# EAGLE design espurna (EAGLE 7.3.0)
PROJECT_AUTHOR: tinkerman.cat <xose.perez@gmail.com>; PROJECT_LICENSE: MIT; PROJECT_NAME: ESPURNA; PROJECT_VERSION: 0.4.20160703
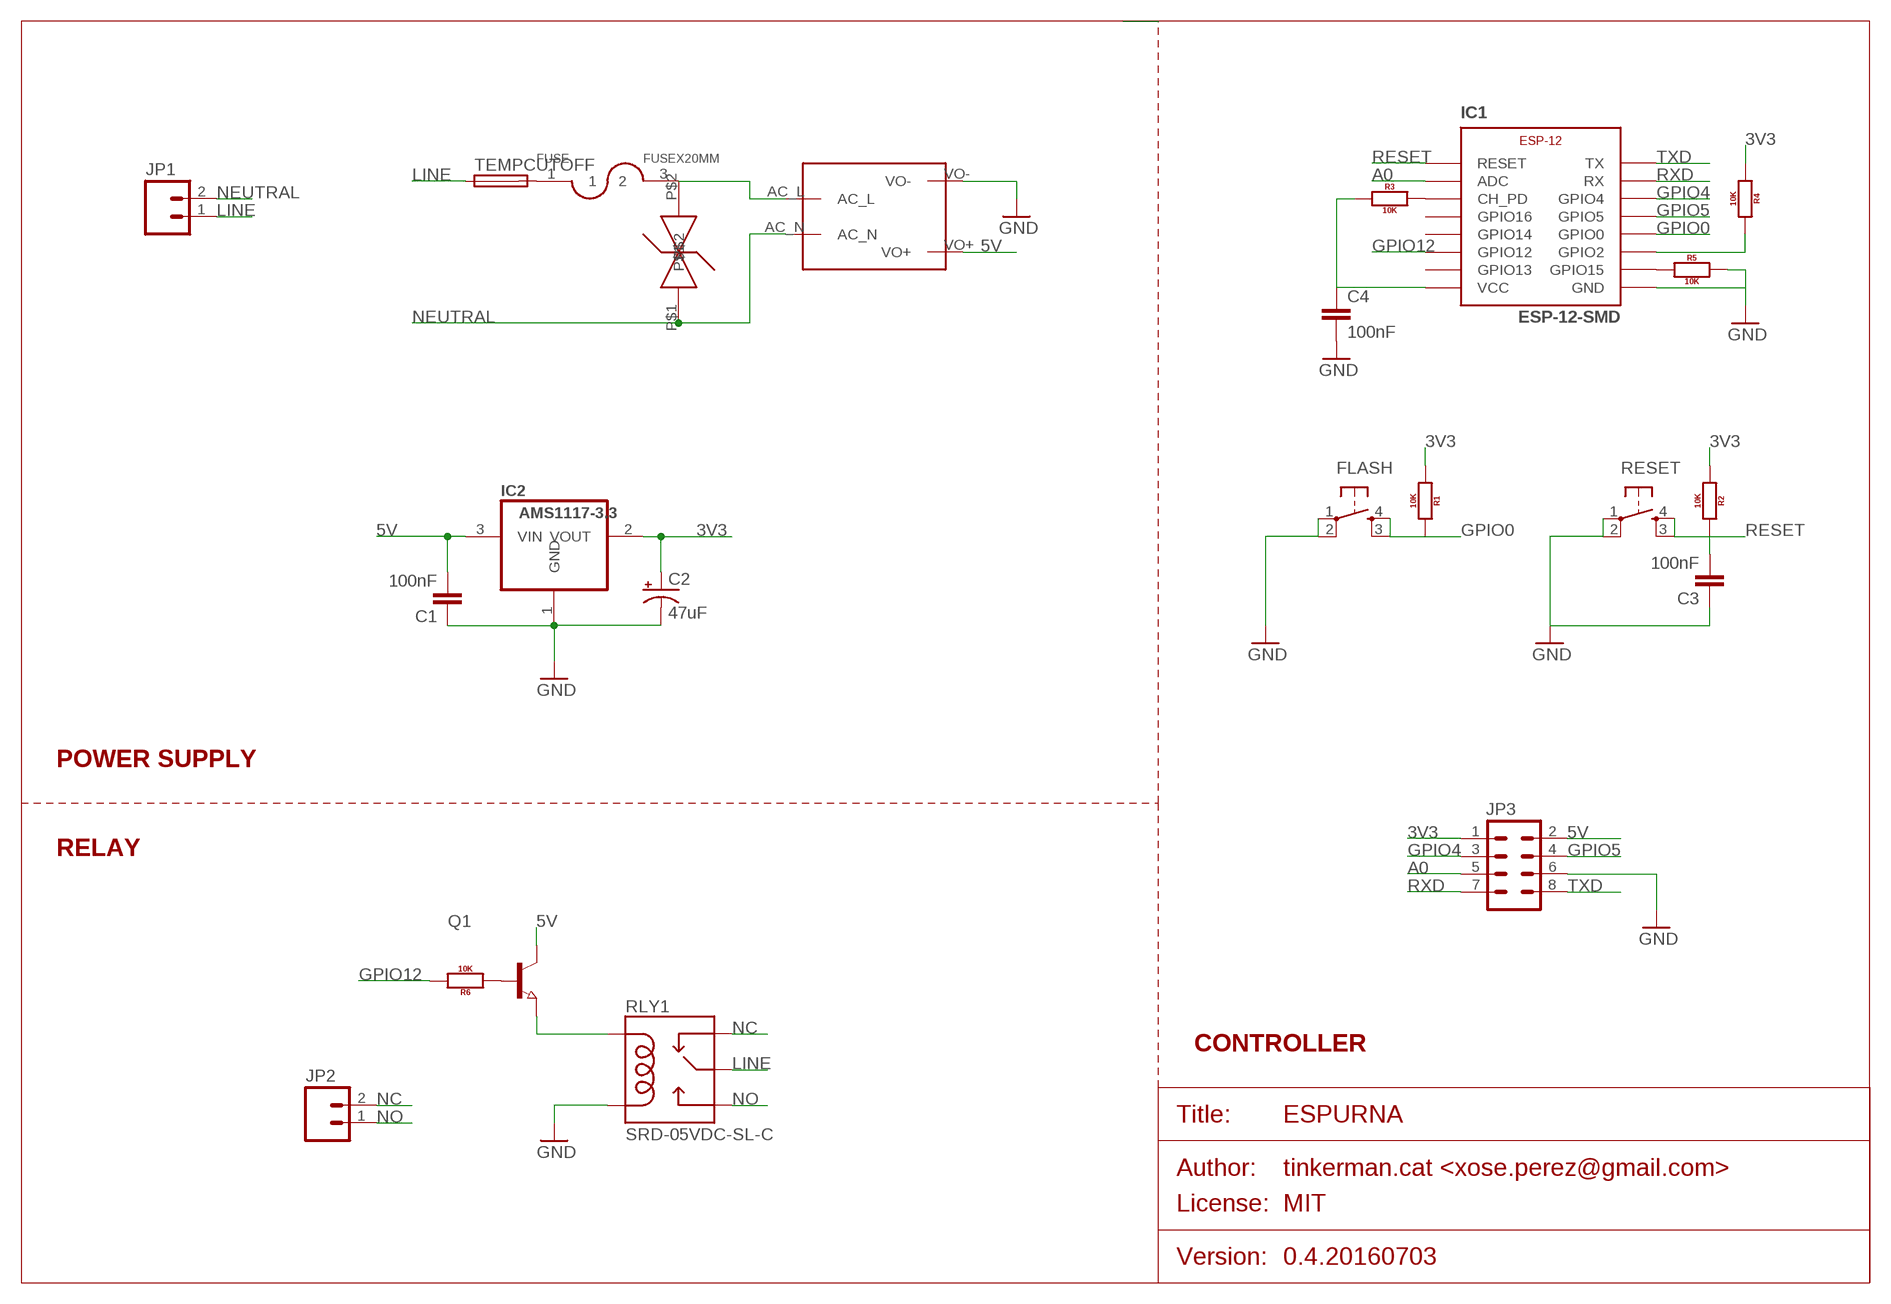
[diagram p0: schematic, sheet 1]

## Parts
C1  100nF  C-EU0805  [0805]
C2  47uF  CAP_POLC  [PANASONIC_C]
C3  100nF  C-EU0805  [0805]
C4  100nF  C-EU0805  [0805]
FLASH  TACTILE_BUTTON_SMD  [TACTILE-BUTTON-SMD]
FUSE  FUSEX20MM  [FUSE_5MM]
IC1  ESP-12-SMD  [ESP-12-SMD]
IC2  AMS1117-3.3  REG1117  [SOT223]
JP1  M02200MIL  [SCREWTERMINAL-200MIL-2]
JP2  M02200MIL  [SCREWTERMINAL-200MIL-2]
JP3  M04X2  [2X4]
Q1  NPN-TRANSISTOR_SOT23  [SOT23]
R1  10K  RESISTOR0805  [0805]
R2  10K  RESISTOR0805  [0805]
R3  10K  RESISTOR0805  [0805]
R4  10K  RESISTOR0805  [0805]
R5  10K  RESISTOR0805  [0805]
R6  10K  RESISTOR0805  [0805]
RESET  TACTILE_BUTTON_SMD  [TACTILE-BUTTON-SMD]
RLY1  SRD-05VDC-SL-C  RELAYSONGLE  [SRD-5VDC-SL-C]
TEMPCUTOFF  PICOFUSE  [PICOFUSE]
U$1  MAINS_CONVERTERS  [HLK-PM01]
VARISTOR  V18ZA2P  [V18ZA2P]

## Nets
3V3: C2.+ C4.1 IC1.VCC IC2.2(VOUT) JP3.1 R1.1 R2.1 R3.1 R4.1
5V: C1.2 IC2.3(VIN) JP3.2 Q1.3(C) U$1.VO+
A0: IC1.ADC JP3.5
GND: C1.1 C2.- C3.1 C4.2 FLASH.1(SWA1) FLASH.2(SWB1) IC1.GND IC2.1(GND) JP3.6 R5.2 RESET.1(SWA1) RESET.2(SWB1) RLY1.COIL2 U$1.VO-
GPIO0: FLASH.3(SWB2) FLASH.4(SWA2) IC1.GPIO0 R1.2
GPIO4: IC1.GPIO4 JP3.3
GPIO5: IC1.GPIO5 JP3.4
GPIO12: IC1.GPIO12 R6.2
LINE: JP1.1 RLY1.COMMON(MAIN) TEMPCUTOFF.1
N$1: IC1.CH_PD R3.2
N$3: IC1.GPIO15 R5.1
N$4: IC1.GPIO2 R4.2
N$5: Q1.1(B) R6.1
N$6: FUSE.1 TEMPCUTOFF.2
N$7: Q1.2(E) RLY1.COIL1
N$8: FUSE.3 U$1.AC_L VARISTOR.P$2
NC: JP2.2 RLY1.CLOSED(NC)
NEUTRAL: JP1.2 U$1.AC_N VARISTOR.P$1
NO: JP2.1 RLY1.OPEN(NO)
RESET: C3.2 IC1.RESET R2.2 RESET.3(SWB2) RESET.4(SWA2)
RXD: IC1.RX JP3.7
TXD: IC1.TX JP3.8
Unconnected: IC1.GPIO13 IC1.GPIO14 IC1.GPIO16

## Notes on the sheet
- POWER SUPPLY
- RELAY
- CONTROLLER

## Library data of the parts
C1 C3 C4 = xose:C-EU: CAPACITOR, European symbol
C2 = xose:CAP_POL: Capacitor Polarized These are standard SMD and PTH capacitors. Normally 10uF, 47uF, and 100uF in electrolytic and tantalum varieties. Always verify the external diameter of the through hole cap, it varies with capacity, voltage, and manufacturer. The EIA devices should be standard.
FLASH RESET = xose:TACTILE_BUTTON: Tactile Button SparkFun Electronics' Tactile Button COM-10302
FUSE = xose:FUSE
IC1 = xose:ESP-12
IC2 = xose:REG1117: 800mA and 1A Low Dropout (LDO) Positive Regulator 1.8V, 2.5V, 2.85V, 3.3V, 5V, and Adj; MPN: REG1117; OC_FARNELL: 1097566; OC_NEWARK: 14P6981
JP1 JP2 = xose:M02: Standard 2-pin 0.1" header. Use with - straight break away headers ( PRT-00116) - right angle break away headers (PRT-00553) - swiss pins (PRT-00743) - machine pins (PRT-00117) - female headers (PRT-00115) Molex polarized connector foot print use with: PRT-08233 with associated crimp pins and housings. 2.54_SCREWTERM for use with PRT-10571. 3.5mm Screw Terminal footprints for PRT-08084 5mm Screw Terminal footprints for use with PRT-08432
JP3 = xose:M04X2: .1" header, two rows of four.
Q1 = xose:NPN-TRANSISTOR_: NPN TRANSISTOR
R1-R6 = xose:RESISTOR: Generic EU resistor symbol
RLY1 = Spark:RELAY: SPDT relay (COM-00101)
TEMPCUTOFF = fuse:PICOFUSE: PICOFUSE 19275, Wickmann; OC_FARNELL: unknown; OC_NEWARK: unknown
U$1 = captain-slow:MAINS_CONVERTERS
VARISTOR = SparkFun-DiscreteSemi:V18ZA2P: Varistor

## Board
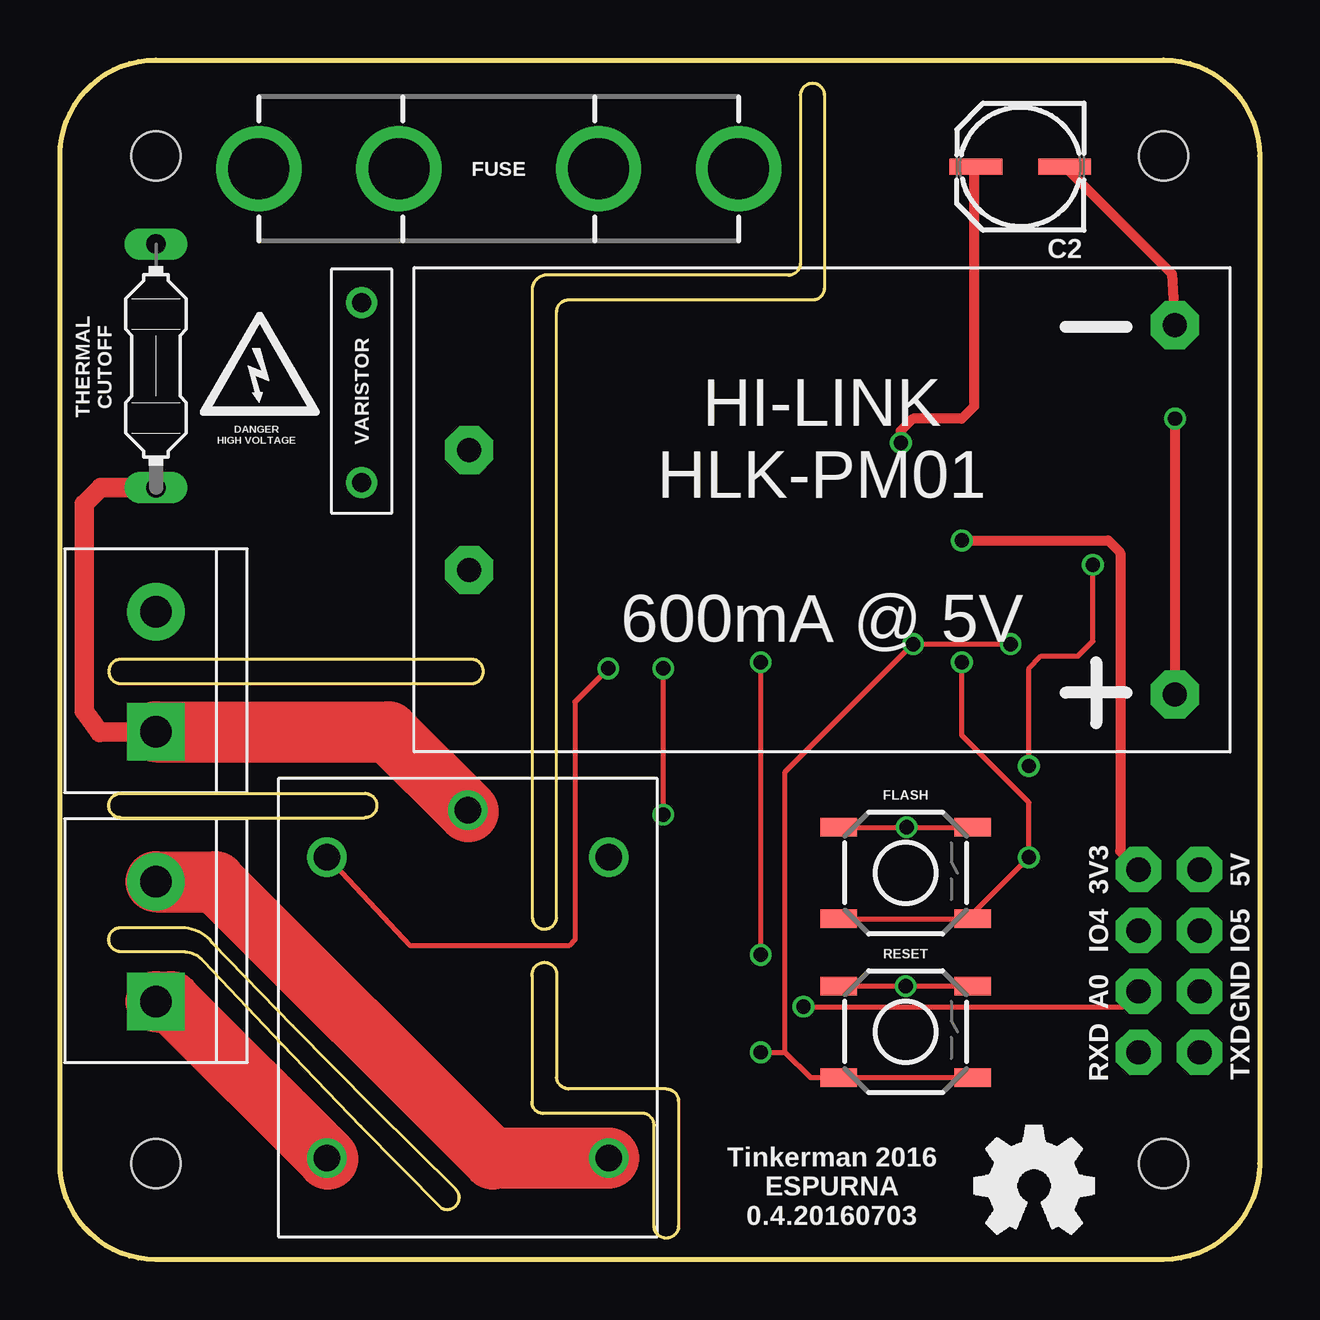
[diagram p1: board, top side]
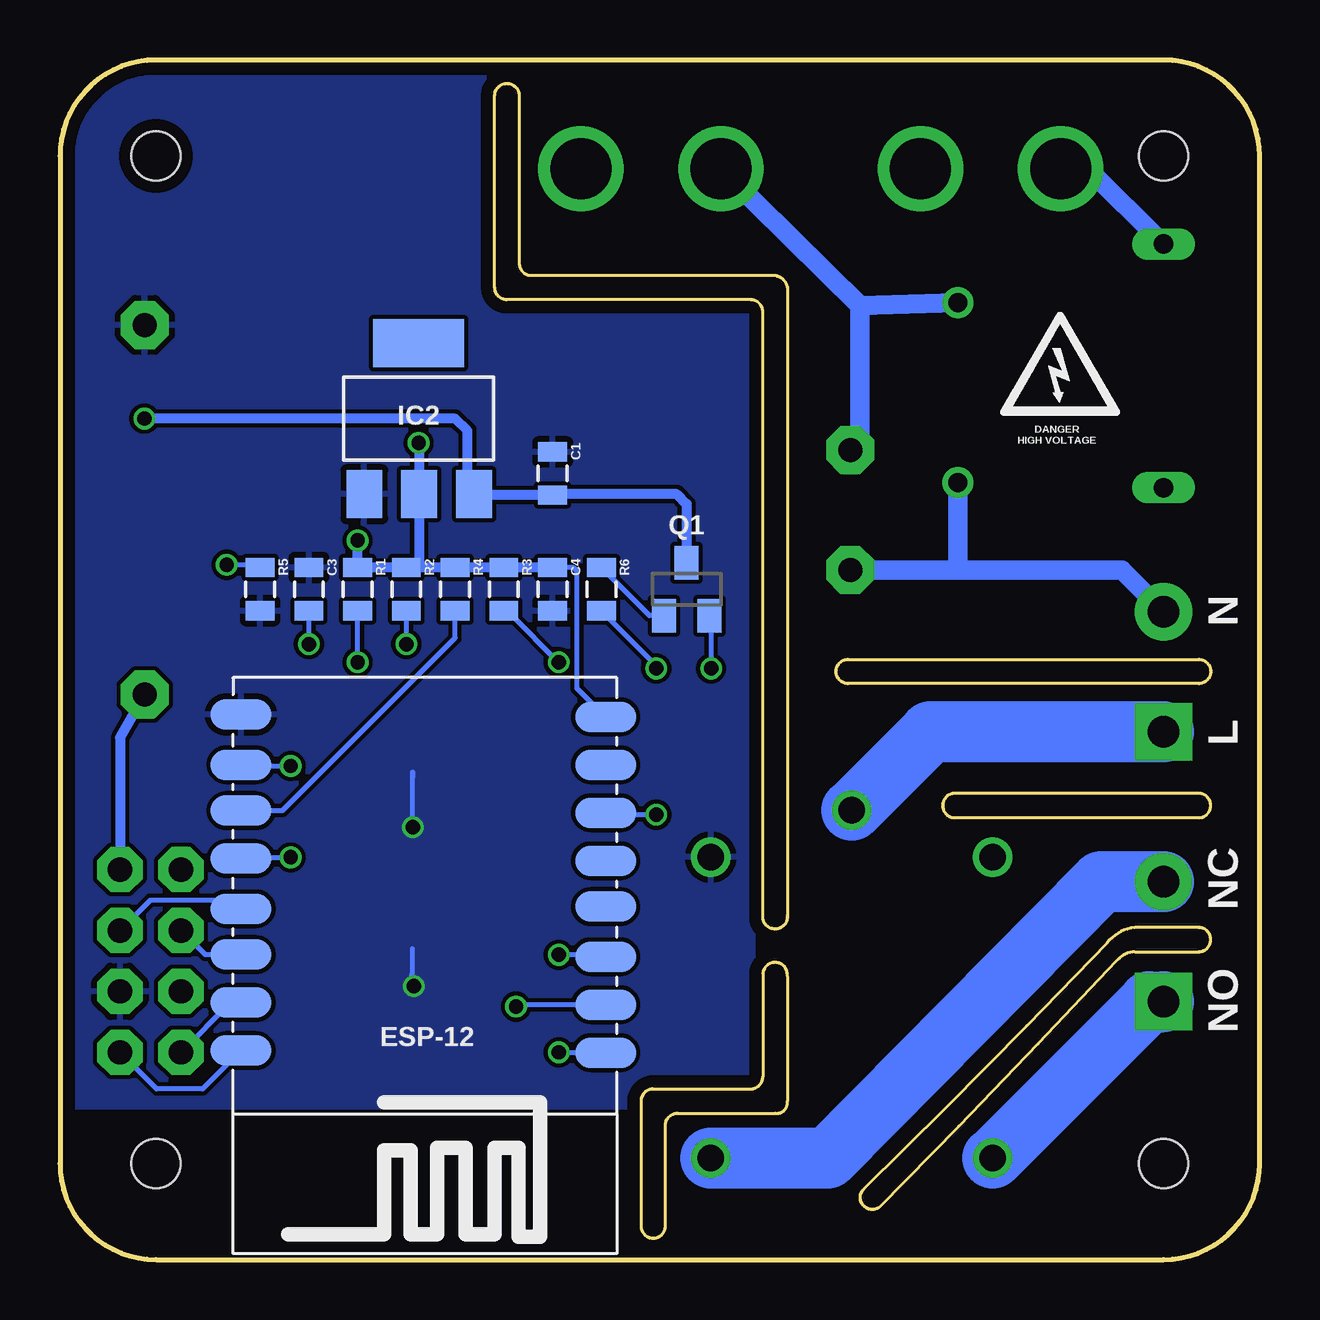
[diagram p2: board, bottom side, seen from below]

Size 50 x 50 mm. Coordinates in mm from the lower left corner, seen from the top.
Outline: 0,4 0,46 arc-90 4,50 46,50 arc-90 50,46 50,4 arc-90 46,0 4,0 arc-90 0,4
Outline: 5.21,12.83 arc-46 5.97,12.45 arc2 15.88,2.16 arc164 16.51,2.92 arc-2 6.35,13.21 arc44 5.21,13.84 2.54,13.84 arc180 2.54,12.83 5.21,12.83
Outline: 2.54,18.41 12.7,18.41 arc180 12.7,19.43 2.54,19.43 arc180 2.54,18.41
Outline: 2.54,24 17.14,24 arc180 17.14,25.02 2.54,25.02 arc180 2.54,24
Outline: 19.68,14.35 arc180 20.7,14.22 20.7,39.5 arc-90 21.21,40.01 31.37,40.01 arc90 31.88,40.51 31.88,48.51 arc180 30.86,48.51 30.86,41.53 arc-90 30.35,41.02 20.19,41.02 arc74 19.68,40.51 19.68,14.35
Outline: 19.68,11.81 arc-180 20.7,11.94 20.7,7.62 arc90 21.21,7.11 25.27,7.11 arc-90 25.78,6.6 25.78,1.4 arc-180 24.77,1.4 24.77,5.59 arc90 24.26,6.1 20.19,6.1 arc-106 19.68,6.6 19.68,11.81
Copper layers (1*16): Top 0.035mm / dielectric 1.5mm / Bottom 0.035mm
Design rules "smart-prototyping": minimum track width 7mil, minimum drill 12mil, track to track 7mil, track to pad 7mil, pad to pad 7mil, via to via 7mil, smd to smd 0mil, copper to edge 20mil, drill to drill 10mil, minimum pad ring 10mil, minimum via ring 6mil, stop-mask expansion 2mil, vias tented up to drill 25mil, thermal gap 10mil
Holes 2.03 mm at 4,4 46,4 46,46 4,46

### Footprints (pad centres in the part's own frame; a part is rotated, then mirrored left to right if it is on the bottom)
0805 = smd 0.8 x 1.2: 1 -0.9,0; 2 0.9,0
PANASONIC_C = smd 2.2 x 0.65: + 1.9,-0.2; - -1.8,-0.2
TACTILE-BUTTON-SMD = smd 1.524 x 0.762: 1 -2.794,1.905; 2 2.794,1.905; 3 -2.794,-1.905; 4 2.794,-1.905
FUSE_5MM = drill 2.54 pad 3.556: 1 0,-10; 2 0,-4.158; 3 0,4.158; 4 0,10
ESP-12-SMD = smd 2.54 x 1.27: ADC -7,5.1; CH_PD -7,3.1; GND 8.2,-7; GPIO0 8.2,-1; GPIO2 8.2,-3; GPIO4 8.2,3; GPIO5 8.2,1.1; GPIO12 -7,-2.9; GPIO13 -7,-4.9; GPIO14 -7,-0.9; GPIO15 8.2,-4.9; GPIO16 -7,1; RESET -7,7.1; RX 8.2,5; TX 8.2,7; VCC -7,-6.9
SOT223 = smd 1.499 x 2.007: 1 -2.261,-3.15; 2 0.025,-3.15; 3 2.311,-3.15 | smd 3.81 x 2.007: 4 0,3.15
SCREWTERMINAL-200MIL-2 = drill 1.3 pad 2.413 square: 1 0,0 | drill 1.3 pad 2.413: 2 5,0
2X4 = drill 1.016 pad 1.88 octagon: 1 -3.81,-1.27; 2 -3.81,1.27; 3 -1.27,-1.27; 4 -1.27,1.27; 5 1.27,-1.27; 6 1.27,1.27; 7 3.81,-1.27; 8 3.81,1.27
SOT23 = smd 1 x 1.4: 1 -0.95,-1.1; 2 0.95,-1.1; 3 0,1.1
SRD-5VDC-SL-C = drill 1.1: CLOSED -6.275,-5.875; COIL1 6.275,5.875; COIL2 6.275,-5.875; COMMON 8.225,0; OPEN -6.275,5.875
PICOFUSE = drill 0.813 long: 1 -5.08,0; 2 5.08,0
HLK-PM01 = drill 1 pad 2 octagon: AC_L -14.7,2.5; AC_N -14.7,-2.5; VO+ 14.7,-7.7; VO- 14.7,7.7
V18ZA2P = drill 0.8: P$1 0,0; P$2 7.5,0

### Placement (x,y rotation side)
C1  29.46,32.77 270 bottom
C2  40.08,45.35 180 top
C3  39.62,27.94 270 bottom
C4  29.46,27.94 270 bottom
FLASH  35.25,16.11 0 top
FUSE  18.29,45.47 270 top
IC1  34.25,15.72 180 bottom
IC2  35.05,35.05 0 bottom
JP1  4,22 90 top
JP2  4,10.75 90 top
JP3  46.23,12.45 270 top
Q1  23.88,27.94 0 bottom
R1  37.59,27.94 270 bottom
R2  35.56,27.94 270 bottom
R3  31.5,27.94 270 bottom
R4  33.53,27.94 270 bottom
R5  41.66,27.94 270 bottom
R6  27.43,27.94 270 bottom
RESET  35.25,9.49 0 top
RLY1  17,10.5 90 top
TEMPCUTOFF  4,37.25 90 top
U$1  31.76,31.25 0 top
VARISTOR  12.57,32.38 90 top

### Tracks (layer width: path | path; a pad name or v marks a point on that pad's centre or on a via)
3V3  (via drill 0.6)
  Top 0.406: C2.+ 38.1,45.47 38.1,35.56 37.59,35.05 35.56,35.05 35.05,34.54 v35.05,34.04 | JP3.1 44.2,17.02 44.2,29.46 43.69,29.97 v37.59,29.97
  Bottom 0.203: IC1.VCC 28.45,23.81 28.45,28.7 28.59,28.84 C4.1
  Bottom 0.406: v35.05,34.04 35.03,34.01 IC2.2 35.03,28.86 35.05,28.84 | C4.1 R3.1 R4.1 35.05,28.84 | 35.05,28.84 R2.1 R1.1 v37.59,29.97
5V  (via drill 0.6)
  Top 0.406: v46.48,35.05 46.46,35.03 U$1.VO+
  Bottom 0.406: Q1.3 23.88,31.5 24.28,31.9 29.43,31.9 C1.2 32.7,31.87 IC2.3 33.02,32.18 33.02,34.54 33.53,35.05 v46.48,35.05 | JP3.2 47.5,21.75 U$1.VO+
A0  (via drill 0.6)
  Top 0.203: v30.99,10.54 44.32,10.54 JP3.5
  Bottom 0.203: IC1.ADC 30.91,10.62 v30.99,10.54
GND  (via drill 0.6)
  Top 0.203: FLASH.1 v35.3,18.02 FLASH.2 | RESET.1 v35.25,11.4 RESET.2
  Top 0.406: C2.- 46.34,41.1 U$1.VO-
  Bottom 0.203: v35.3,18.02 35.3,20.31 35.31,20.32 35.31,20.07 | v35.25,11.4 arc60 35.31,11.94 35.31,12.95
  pour Bottom: 32,50 50,50 50,6.38 26,6.38 26,6.35 21.13,6.48 21,40 32,40
GPIO0  (via drill 0.6)
  Top 0.203: FLASH.3 FLASH.4 38.04,14.42 v40.39,16.76 40.39,19.05 37.59,21.84 v37.59,24.89
  Bottom 0.203: IC1.GPIO0 42.4,16.76 v40.39,16.76 | v37.59,24.89 R1.2
GPIO4
  Bottom 0.203: 43.42,12.72 IC1.GPIO4 43.96,12.72 JP3.3
GPIO5
  Bottom 0.203: IC1.GPIO5 42.82,14.99 46.23,14.99 JP3.4
GPIO12  (via drill 0.6)
  Top 0.203: v25.15,18.54 v25.15,24.64
  Bottom 0.203: IC1.GPIO12 27.18,18.54 v25.15,18.54 | v25.15,24.64 25.15,24.75 R6.2
LINE
  Top 0.813: TEMPCUTOFF.1 1.69,32.17 1.02,31.5 1.02,22.86 1.65,21.97 1.68,22 JP1.1
  Top 2.54: JP1.1 13.69,22 17.02,18.67
  Bottom 0.813: 4,21.97 JP1.1
  Bottom 2.54: JP1.1 13.72,22 RLY1.COMMON
N$1  (via drill 0.6)
  Top 0.203: v29.21,12.7 v29.21,24.89
  Bottom 0.203: R3.2 31.5,26.92 31.24,26.92 v29.21,24.89 | IC1.CH_PD 27.34,12.7 v29.21,12.7
N$3  (via drill 0.6)
  Top 0.203: v40.39,20.57 40.39,24.64 40.89,25.15 42.42,25.15 43.05,25.78 v43.05,28.96
  Bottom 0.203: IC1.GPIO15 42.41,20.57 v40.39,20.57 | R5.1 41.77,28.96 v43.05,28.96
N$4
  Bottom 0.203: IC1.GPIO2 40.72,18.72 33.53,25.91 R4.2
N$5
  Bottom 0.203: Q1.1 25.43,26.84 R6.1
N$6
  Bottom 0.813: TEMPCUTOFF.2 7.17,45.5 FUSE.1
N$7  (via drill 0.6)
  Top 0.203: v22.86,24.64 21.46,23.24 21.46,13.34 21.21,13.08 14.61,13.08 11.16,16.77 RLY1.COIL1
  Bottom 0.203: 22.86,26.71 v22.86,24.64
  Bottom 0.406: Q1.2 22.86,26.71
N$8
  Bottom 0.813: VARISTOR.P$2 16.67,39.76 | 16.67,39.76 FUSE.3 | 16.67,39.76 16.67,34.15 U$1.AC_L
NC
  Top 2.54: JP2.2 6.48,15.75 18.03,4.19 18.07,4.22 RLY1.CLOSED
  Bottom 2.54: JP2.2 6.6,15.75 18,4.22 RLY1.CLOSED
NEUTRAL
  Bottom 0.813: JP1.2 5.75,28.75 12.57,28.75 | 12.57,28.75 U$1.AC_N | VARISTOR.P$1 12.57,28.75
NO
  Top 2.54: JP2.1 4.62,10.75 11.18,4.19
  Bottom 2.54: RLY1.OPEN 4.6,10.75 JP2.1
RESET  (via drill 0.6)
  Top 0.203: v29.21,8.64 30.23,8.64 | 30.23,8.64 30.23,20.32 v35.56,25.65 v39.62,25.65 | RESET.4 RESET.3 31.27,7.59 30.23,8.64
  Bottom 0.203: IC1.RESET 29.19,8.62 v29.21,8.64 | v35.56,25.65 R2.2 | v39.62,25.65 C3.2
RXD
  Bottom 0.203: JP3.7 42.88,10.72 IC1.RX
TXD
  Bottom 0.203: IC1.TX 44.06,7.11 45.97,7.11 JP3.8

### Text on the board
tPlace: 3V3 | 5V | IO4 | IO5 | A0 | GND | RXD | TXD
bPlace: N | L | NC | NO
tNames: FUSE | THERMAL / CUTOFF | VARISTOR | DANGER / HIGH VOLTAGE | Tinkerman 2016 / ESPURNA / 0.4.20160703
bNames: DANGER / HIGH VOLTAGE